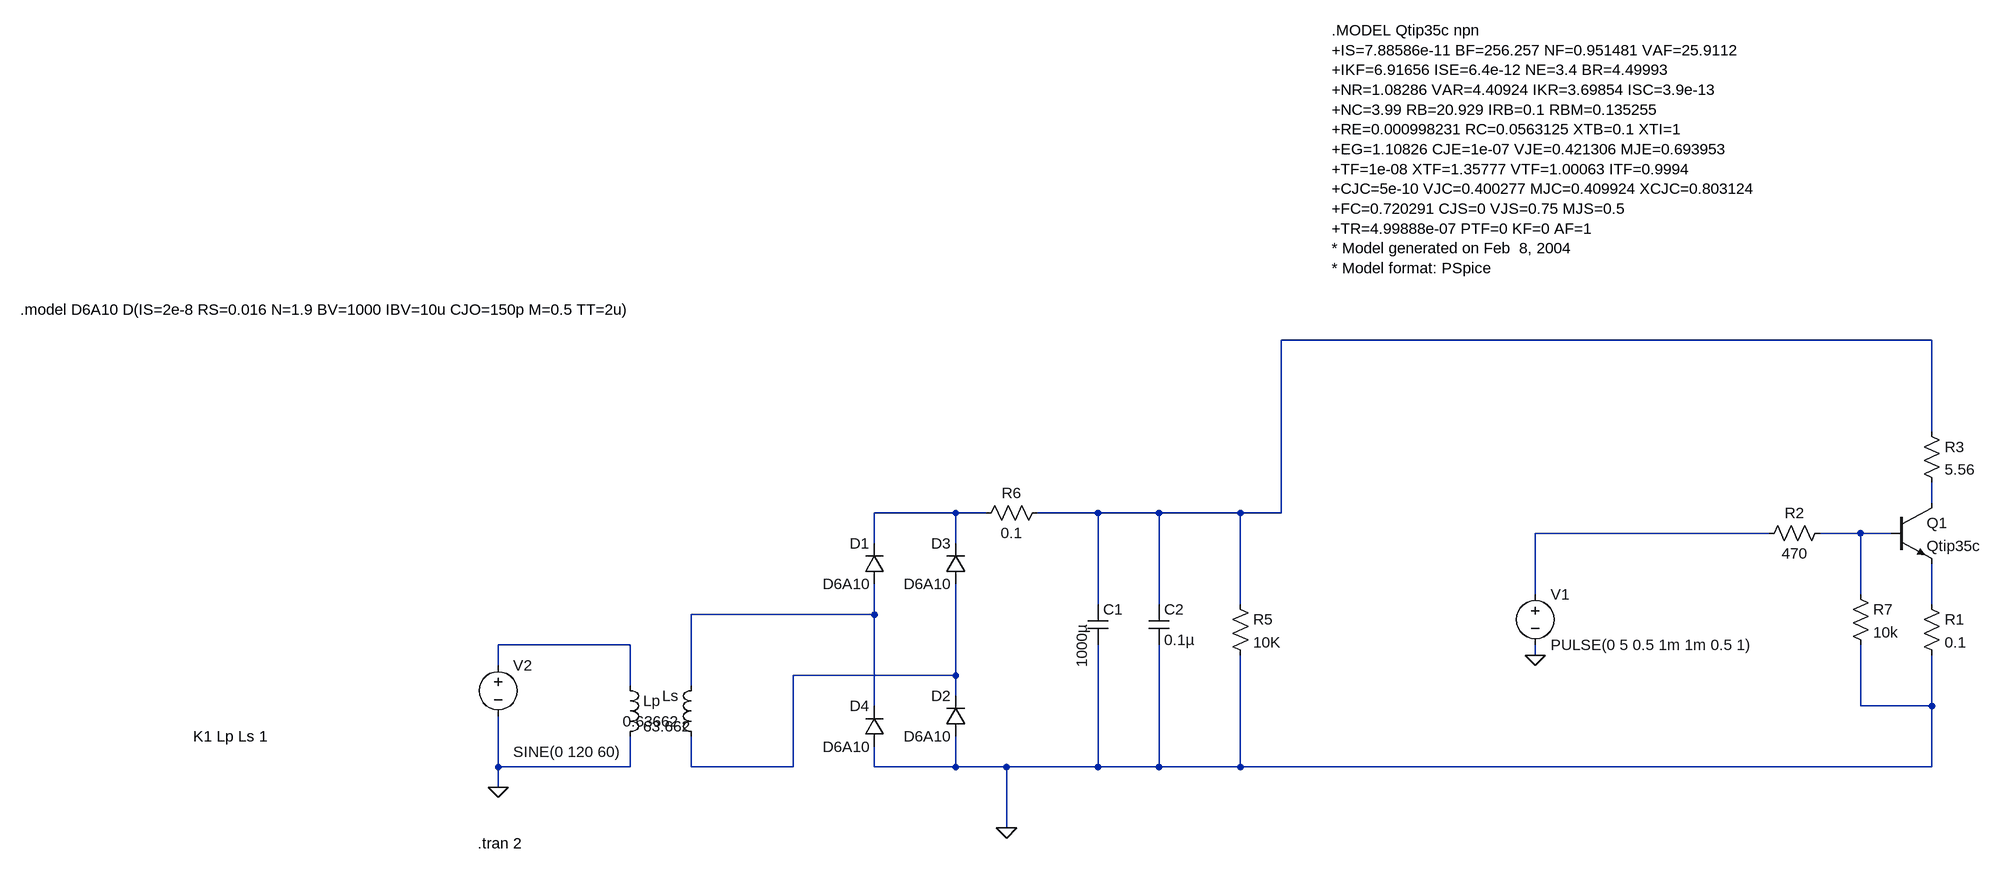
[diagram p0: schematic BJT.asc]
BJT.asc, the LTspice schematic file:
Version 4.1
SHEET 1 2020 680
WIRE 1392 -480 368 -480
WIRE 1392 -336 1392 -480
WIRE 1392 -224 1392 -256
WIRE -144 -208 -272 -208
WIRE -96 -208 -144 -208
WIRE 80 -208 -16 -208
WIRE 176 -208 80 -208
WIRE 304 -208 176 -208
WIRE 368 -208 368 -480
WIRE 368 -208 304 -208
WIRE 1136 -176 768 -176
WIRE 1280 -176 1216 -176
WIRE 1328 -176 1280 -176
WIRE -272 -160 -272 -208
WIRE -144 -160 -144 -208
WIRE 768 -80 768 -176
WIRE 1280 -80 1280 -176
WIRE 80 -64 80 -208
WIRE 176 -64 176 -208
WIRE 304 -64 304 -208
WIRE 1392 -64 1392 -128
WIRE -272 -48 -272 -96
WIRE -272 -48 -560 -48
WIRE -656 0 -864 0
WIRE 768 16 768 0
WIRE -864 32 -864 0
WIRE -144 48 -144 -96
WIRE -144 48 -400 48
WIRE -656 64 -656 0
WIRE -560 64 -560 -48
WIRE -144 80 -144 48
WIRE -272 96 -272 -48
WIRE 1280 96 1280 0
WIRE 1392 96 1392 16
WIRE 1392 96 1280 96
WIRE -864 192 -864 112
WIRE -656 192 -656 144
WIRE -656 192 -864 192
WIRE -560 192 -560 144
WIRE -400 192 -400 48
WIRE -400 192 -560 192
WIRE -272 192 -272 160
WIRE -144 192 -144 144
WIRE -144 192 -272 192
WIRE -64 192 -144 192
WIRE 80 192 80 0
WIRE 80 192 -64 192
WIRE 176 192 176 0
WIRE 176 192 80 192
WIRE 304 192 304 16
WIRE 304 192 176 192
WIRE 1392 192 1392 96
WIRE 1392 192 304 192
WIRE -864 224 -864 192
WIRE -64 288 -64 192
FLAG -64 288 0
FLAG -864 224 0
FLAG 768 16 0
SYMBOL diode -256 -96 R180
WINDOW 0 24 64 Left 2
WINDOW 3 24 0 Left 2
SYMATTR InstName D1
SYMATTR Value D6A10
SYMBOL diode -128 144 R180
WINDOW 0 24 64 Left 2
WINDOW 3 24 0 Left 2
SYMATTR InstName D2
SYMATTR Value D6A10
SYMBOL diode -128 -96 R180
WINDOW 0 24 64 Left 2
WINDOW 3 24 0 Left 2
SYMATTR InstName D3
SYMATTR Value D6A10
SYMBOL diode -256 160 R180
WINDOW 0 24 64 Left 2
WINDOW 3 24 0 Left 2
SYMATTR InstName D4
SYMATTR Value D6A10
SYMBOL cap 64 -64 R0
WINDOW 3 -9 100 VLeft 2
SYMATTR Value 1000µ
SYMATTR InstName C1
SYMATTR SpiceLine V=50 Irms=1.2 Rser=0.044 Lser=13.616n
SYMBOL voltage -864 16 R0
WINDOW 3 24 152 Left 2
WINDOW 123 24 124 Left 2
WINDOW 39 0 0 Left 0
SYMATTR Value SINE(0 120 60)
SYMATTR InstName V2
SYMBOL ind -672 48 R0
SYMATTR InstName Lp
SYMATTR Value 63.662
SYMATTR Type ind
SYMATTR SpiceLine Rser=0.01
SYMBOL ind -544 160 R180
WINDOW 0 36 80 Left 2
WINDOW 3 36 40 Left 2
SYMATTR InstName Ls
SYMATTR Value 0.63662
SYMATTR Type ind
SYMBOL res 1376 -352 R0
SYMATTR InstName R3
SYMATTR Value 5.56
SYMATTR SpiceLine tol=5 pwr=25
SYMBOL voltage 768 -96 R0
WINDOW 123 0 0 Left 0
WINDOW 39 0 0 Left 0
SYMATTR InstName V1
SYMATTR Value PULSE(0 5 0.5 1m 1m 0.5 1)
SYMBOL res 288 -80 R0
SYMATTR InstName R5
SYMATTR Value 10K
SYMATTR SpiceLine tol=1 pwr=0.1
SYMBOL res 0 -224 R90
WINDOW 0 0 56 VBottom 2
WINDOW 3 32 56 VTop 2
SYMATTR InstName R6
SYMATTR Value 0.1
SYMATTR SpiceLine tol=5 pwr=1
SYMBOL cap 160 -64 R0
SYMATTR InstName C2
SYMATTR Value 0.1µ
SYMATTR SpiceLine V=16 Irms=0 Rser=0 Lser=0 mfg="Murata" pn="GRM022R61C103KE01" type="X5R"
SYMBOL res 1376 -80 R0
SYMATTR InstName R1
SYMATTR Value 0.1
SYMATTR SpiceLine tol=5 pwr=1/4
SYMBOL res 1232 -192 R90
WINDOW 0 0 56 VBottom 2
WINDOW 3 32 56 VTop 2
SYMATTR InstName R2
SYMATTR Value 470
SYMATTR SpiceLine tol=5 pwr=2
SYMBOL res 1264 -96 R0
SYMATTR InstName R7
SYMATTR Value 10k
SYMBOL npn 1328 -224 R0
SYMATTR InstName Q1
SYMATTR Value Qtip35c
TEXT -1616 -528 Left 2 !.model D6A10 D(IS=2e-8 RS=0.016 N=1.9 BV=1000 IBV=10u CJO=150p M=0.5 TT=2u)
TEXT -896 312 Left 2 !.tran 2
TEXT -1344 144 Left 2 !K1 Lp Ls 1
TEXT 448 -968 Left 2 !.MODEL Qtip35c npn\n+IS=7.88586e-11 BF=256.257 NF=0.951481 VAF=25.9112\n+IKF=6.91656 ISE=6.4e-12 NE=3.4 BR=4.49993\n+NR=1.08286 VAR=4.40924 IKR=3.69854 ISC=3.9e-13\n+NC=3.99 RB=20.929 IRB=0.1 RBM=0.135255\n+RE=0.000998231 RC=0.0563125 XTB=0.1 XTI=1\n+EG=1.10826 CJE=1e-07 VJE=0.421306 MJE=0.693953\n+TF=1e-08 XTF=1.35777 VTF=1.00063 ITF=0.9994\n+CJC=5e-10 VJC=0.400277 MJC=0.409924 XCJC=0.803124\n+FC=0.720291 CJS=0 VJS=0.75 MJS=0.5\n+TR=4.99888e-07 PTF=0 KF=0 AF=1\n* Model generated on Feb  8, 2004\n* Model format: PSpice

The netlist it stands for:
* BJT.asc
D1 N007 N003 D6A10
D2 0 N009 D6A10
D3 N009 N003 D6A10
D4 0 N007 D6A10
C1 N001 0 1000µ V=50 Irms=1.2 Rser=0.044 Lser=13.616n
V2 N008 0 SINE(0 120 60)
Lp N008 0 63.662 Rser=0.01
Ls N009 N007 0.63662
R3 N001 N002 5.56 tol=5 pwr=25
V1 N004 0 PULSE(0 5 0.5 1m 1m 0.5 1)
R5 N001 0 10K tol=1 pwr=0.1
R6 N001 N003 0.1 tol=5 pwr=1
C2 N001 0 0.1µ V=16 Irms=0 Rser=0 Lser=0 mfg="Murata" pn="GRM022R61C103KE01" type="X5R"
R1 N006 0 0.1 tol=5 pwr=1/4
R2 N005 N004 470 tol=5 pwr=2
R7 N005 0 10k
Q1 N002 N005 N006 0 Qtip35c
.model D D
.lib standard.dio
.model NPN NPN
.model PNP PNP
.lib standard.bjt
.model D6A10 D(IS=2e-8 RS=0.016 N=1.9 BV=1000 IBV=10u CJO=150p M=0.5 TT=2u)
.tran 2
K1 Lp Ls 1
.MODEL Qtip35c npn
+IS=7.88586e-11 BF=256.257 NF=0.951481 VAF=25.9112
+IKF=6.91656 ISE=6.4e-12 NE=3.4 BR=4.49993
+NR=1.08286 VAR=4.40924 IKR=3.69854 ISC=3.9e-13
+NC=3.99 RB=20.929 IRB=0.1 RBM=0.135255
+RE=0.000998231 RC=0.0563125 XTB=0.1 XTI=1
+EG=1.10826 CJE=1e-07 VJE=0.421306 MJE=0.693953
+TF=1e-08 XTF=1.35777 VTF=1.00063 ITF=0.9994
+CJC=5e-10 VJC=0.400277 MJC=0.409924 XCJC=0.803124
+FC=0.720291 CJS=0 VJS=0.75 MJS=0.5
+TR=4.99888e-07 PTF=0 KF=0 AF=1
* Model generated on Feb  8, 2004
* Model format: PSpice
.backanno
.end